# Altium project Aquecedor_Inteligente.PrjPcb
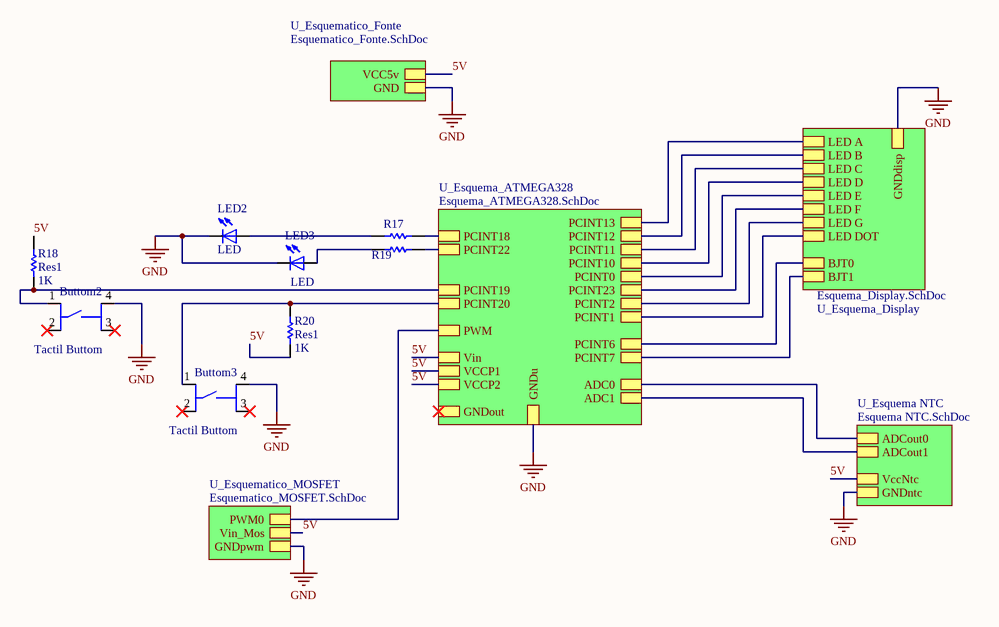
[diagram p0: Esquema_Principal.SchDoc]
6 sheets, 52 parts. Net scope: hierarchical (ports join the sheet entries above them; power ports are global).
Board file: PCB_Aquecedor.PcbDoc
Sheets:
  Esquema_Principal.SchDoc
    U_Esquema_ATMEGA328 = Esquema_ATMEGA328.SchDoc
    U_Esquema_Display = Esquema_Display.SchDoc
    U_Esquematico_Fonte = Esquematico_Fonte.SchDoc
    U_Esquema NTC = Esquema NTC.SchDoc
    U_Esquematico_MOSFET = Esquematico_MOSFET.SchDoc

## Sheet Esquema_Principal.SchDoc
size A4

### Parts
Buttom2  Tactil Buttom  [Tactil Buttom]
Buttom3  Tactil Buttom  [Tactil Buttom]
LED2  LED  [Led_THT]
LED3  LED  [Led_THT]
R17  Res1  [AXIAL-0.3]  (value not drawn)
R18  Res1  value 1K  [AXIAL-0.3]
R19  Res1  [AXIAL-0.3]  (value not drawn)
R20  Res1  value 1K  [AXIAL-0.3]

### Sub-sheets
U_Esquema NTC = Esquema NTC.SchDoc: ADCout0, ADCout1, GNDntc, VccNtc
U_Esquema_ATMEGA328 = Esquema_ATMEGA328.SchDoc: Vin, PCINT18, PCINT19, PCINT6, PCINT7, PWM, PCINT22, PCINT23, PCINT0, PCINT13, PCINT12, PCINT11, PCINT10, ADC1, ADC0, GNDout, PCINT2, PCINT1, PCINT20, VCCP1, VCCP2, GNDu
U_Esquema_Display = Esquema_Display.SchDoc: BJT0, BJT1, LED A, LED B, LED C, LED D, LED E, LED F, LED G, LED DOT, GNDdisp
U_Esquematico_Fonte = Esquematico_Fonte.SchDoc: VCC5v, GND
U_Esquematico_MOSFET = Esquematico_MOSFET.SchDoc: PWM0, Vin_Mos, GNDpwm

### Nets
GND: Buttom2.4 Buttom3.4 LED2.K(C) LED3.K(C) ; sheet U_Esquema_ATMEGA328/GNDu, sheet U_Esquema_Display/GNDdisp, sheet U_Esquematico_Fonte/GND, sheet U_Esquema NTC/GNDntc, sheet U_Esquematico_MOSFET/GNDpwm
5V: R18.2 R20.1 ; sheet U_Esquema_ATMEGA328/Vin, sheet U_Esquema_ATMEGA328/VCCP1, sheet U_Esquema_ATMEGA328/VCCP2, sheet U_Esquematico_Fonte/VCC5v, sheet U_Esquema NTC/VccNtc, sheet U_Esquematico_MOSFET/Vin_Mos
NetButtom2_1: Buttom2.1 R18.1 ; sheet U_Esquema_ATMEGA328/PCINT19
NetButtom3_1: Buttom3.1 R20.2 ; sheet U_Esquema_ATMEGA328/PCINT20
NetCAP3_1: sheet U_Esquema_ATMEGA328/ADC0, sheet U_Esquema NTC/ADCout0
NetCAP7_1: sheet U_Esquema_ATMEGA328/ADC1, sheet U_Esquema NTC/ADCout1
NetIC1_4: R17.2 ; sheet U_Esquema_ATMEGA328/PCINT18
NetIC1_9: sheet U_Esquema_ATMEGA328/PCINT6, sheet U_Esquema_Display/BJT0
NetIC1_10: sheet U_Esquema_ATMEGA328/PCINT7, sheet U_Esquema_Display/BJT1
NetIC1_11: sheet U_Esquema_ATMEGA328/PWM, sheet U_Esquematico_MOSFET/PWM0
NetIC1_12: R19.2 ; sheet U_Esquema_ATMEGA328/PCINT22
NetIC1_13: sheet U_Esquema_ATMEGA328/PCINT23, sheet U_Esquema_Display/LED F
NetIC1_14: sheet U_Esquema_ATMEGA328/PCINT0, sheet U_Esquema_Display/LED E
NetIC1_15: sheet U_Esquema_ATMEGA328/PCINT1, sheet U_Esquema_Display/LED DOT
NetIC1_16: sheet U_Esquema_ATMEGA328/PCINT2, sheet U_Esquema_Display/LED G
NetIC1_25: sheet U_Esquema_ATMEGA328/PCINT10, sheet U_Esquema_Display/LED D
NetIC1_26: sheet U_Esquema_ATMEGA328/PCINT11, sheet U_Esquema_Display/LED C
NetIC1_27: sheet U_Esquema_ATMEGA328/PCINT12, sheet U_Esquema_Display/LED B
NetIC1_28: sheet U_Esquema_ATMEGA328/PCINT13, sheet U_Esquema_Display/LED A
NetLED2_A: LED2.A R17.1
NetLED3_A: LED3.A R19.1

Not connected (* = marked no-connect by the designer): Buttom2 2* 3*; Buttom3 2* 3*

### Library data of the parts
R17 R19 = Res1: Resistor; Value: 1K; Published: 8-Jun-2000; LatestRevisionDate: 17-Jul-2002; LatestRevisionNote: Re-released for DXP Platform.; PackageReference: AXIAL-0.3; Publisher: Altium Limited; PackageDescription: Axial Device, Thru-Hole; 2 Leads; 0.3 in Pin Spacing
R18 R20 = Res1: Resistor; Published: 8-Jun-2000; LatestRevisionDate: 17-Jul-2002; LatestRevisionNote: Re-released for DXP Platform.; PackageReference: AXIAL-0.3; Publisher: Altium Limited; PackageDescription: Axial Device, Thru-Hole; 2 Leads; 0.3 in Pin Spacing

## Sheet Esquema_ATMEGA328.SchDoc
size A4
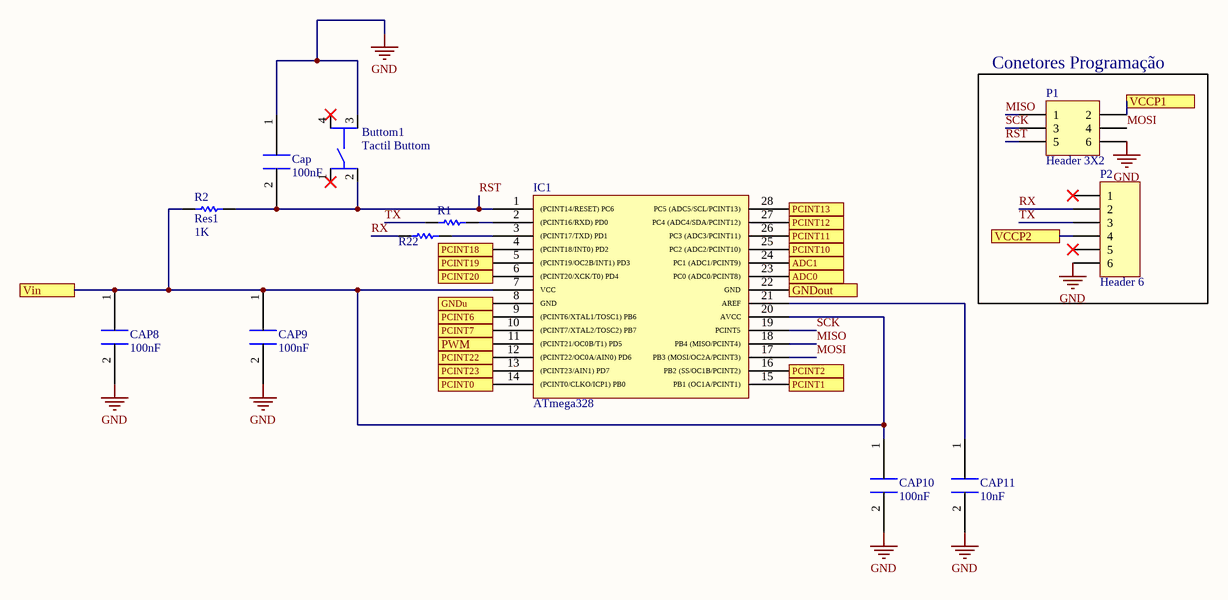
[diagram p1: Esquema_ATMEGA328.SchDoc]

### Parts
Buttom1  Tactil Buttom  [Tactil Buttom]
Cap  100nF  [Capacitor Eletro]
CAP8  100nF  [Capacitor Eletro]
CAP9  100nF  [Capacitor Eletro]
CAP10  100nF  [Capacitor Eletro]
CAP11  10nF  [Capacitor Eletro]
IC1  ATmega328  [ATmega328]
P1  Header 3X2  [HDR2X3]
P2  Header 6  [HDR1X6]
R1  Res1  [AXIAL-0.3]  (value not drawn)
R2  Res1  value 1K  [AXIAL-0.3]
R22  Res1  [AXIAL-0.3]  (value not drawn)

### Blocks framed on the sheet
Conetores Programação: P1 P2

### Ports
ADC0, ADC1, GNDout, GNDu, PCINT0, PCINT1, PCINT2, PCINT6, PCINT7, PCINT10, PCINT11, PCINT12, PCINT13, PCINT18, PCINT19, PCINT20, PCINT22, PCINT23, PWM, VCCP1, VCCP2, Vin

### Nets
GND: Buttom1.3 Cap.1 CAP8.2 CAP9.2 CAP10.2 CAP11.2 IC1.8(GND) P1.6 P2.6 ; port GNDu
5V: CAP8.1 CAP9.1 CAP10.1 IC1.7(VCC) IC1.20(AVCC) P1.2 P2.4 R2.1 ; port Vin, port VCCP1, port VCCP2
MISO: IC1.18(PB4_(MISO/PCINT4)) P1.1
MOSI: IC1.17(PB3_(MOSI/OC2A/PCINT3)) P1.4
RST: Buttom1.2 Cap.2 IC1.1((PCINT14/RESET)_PC6) P1.5 R2.2
RX: P2.2 R22.1
SCK: IC1.19(PCINT5) P1.3
TX: P2.3 R1.1
NetButtom2_1: IC1.5((PCINT19/OC2B/INT1)_PD3) ; port PCINT19
NetButtom3_1: IC1.6((PCINT20/XCK/T0)_PD4) ; port PCINT20
NetCAP3_1: IC1.23(PC0_(ADC0/PCINT8)) ; port ADC0
NetCAP7_1: IC1.24(PC1_(ADC1/PCINT9)) ; port ADC1
NetCAP11_1: CAP11.1 IC1.21(AREF)
NetIC1_2: IC1.2((PCINT16/RXD)_PD0) R1.2
NetIC1_3: IC1.3((PCINT17/TXD)_PD1) R22.2
NetIC1_4: IC1.4((PCINT18/INT0)_PD2) ; port PCINT18
NetIC1_9: IC1.9((PCINT6/XTAL1/TOSC1)_PB6) ; port PCINT6
NetIC1_10: IC1.10((PCINT7/XTAL2/TOSC2)_PB7) ; port PCINT7
NetIC1_11: IC1.11((PCINT21/OC0B/T1)_PD5) ; port PWM
NetIC1_12: IC1.12((PCINT22/OC0A/AIN0)_PD6) ; port PCINT22
NetIC1_13: IC1.13((PCINT23/AIN1)_PD7) ; port PCINT23
NetIC1_14: IC1.14((PCINT0/CLKO/ICP1)_PB0) ; port PCINT0
NetIC1_15: IC1.15(PB1_(OC1A/PCINT1)) ; port PCINT1
NetIC1_16: IC1.16(PB2_(SS/OC1B/PCINT2)) ; port PCINT2
NetIC1_22: IC1.22(GND) ; port GNDout
NetIC1_25: IC1.25(PC2_(ADC2/PCINT10)) ; port PCINT10
NetIC1_26: IC1.26(PC3_(ADC3/PCINT11)) ; port PCINT11
NetIC1_27: IC1.27(PC4_(ADC4/SDA/PCINT12)) ; port PCINT12
NetIC1_28: IC1.28(PC5_(ADC5/SCL/PCINT13)) ; port PCINT13

Not connected (* = marked no-connect by the designer): Buttom1 1* 4*; P2 1* 5*

### Library data of the parts
Cap CAP8-CAP11 = 33pF: Condensador
P1 = Header 3X2: Header, 3-Pin, Dual row; LatestRevisionDate: 17-Jul-2002; LatestRevisionNote: Re-released for DXP Platform.; Publisher: Altium Limited
P2 = Header 6: Header, 6-Pin; LatestRevisionDate: 17-Jul-2002; LatestRevisionNote: Re-released for DXP Platform.; Publisher: Altium Limited
R1 R22 = Res1: Resistor; Value: 1K; Published: 8-Jun-2000; LatestRevisionDate: 17-Jul-2002; LatestRevisionNote: Re-released for DXP Platform.; PackageReference: AXIAL-0.3; Publisher: Altium Limited; PackageDescription: Axial Device, Thru-Hole; 2 Leads; 0.3 in Pin Spacing
R2 = Res1: Resistor; Published: 8-Jun-2000; LatestRevisionDate: 17-Jul-2002; LatestRevisionNote: Re-released for DXP Platform.; PackageReference: AXIAL-0.3; Publisher: Altium Limited; PackageDescription: Axial Device, Thru-Hole; 2 Leads; 0.3 in Pin Spacing

## Sheet Esquema_Display.SchDoc
size A4
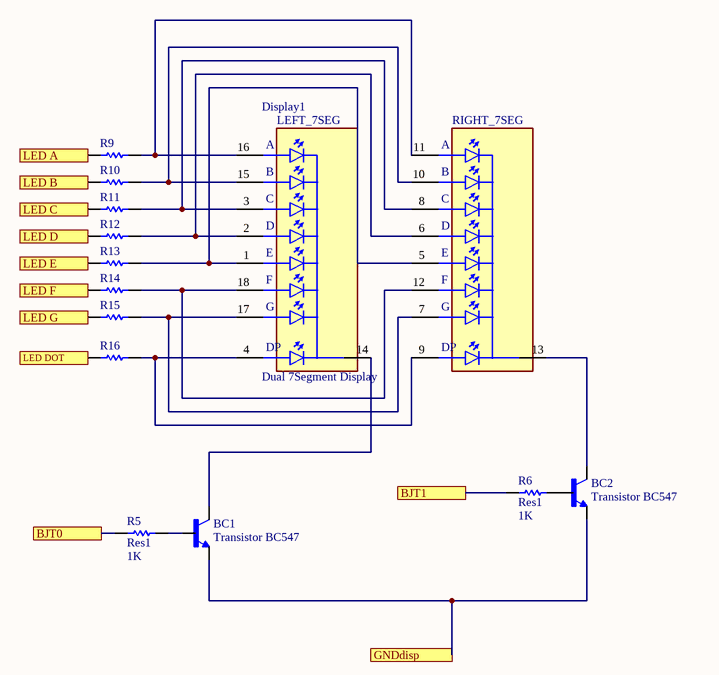
[diagram p2: Esquema_Display.SchDoc]

### Parts
BC1  Transistor BC547  [Transistor BC547]
BC2  Transistor BC547  [Transistor BC547]
Display1  Dual 7Segment Display  [Dual Digit Display]
R5  Res1  value 1K  [AXIAL-0.3]
R6  Res1  value 1K  [AXIAL-0.3]
R9  Res1  [AXIAL-0.3]  (value not drawn)
R10  Res1  [AXIAL-0.3]  (value not drawn)
R11  Res1  [AXIAL-0.3]  (value not drawn)
R12  Res1  [AXIAL-0.3]  (value not drawn)
R13  Res1  [AXIAL-0.3]  (value not drawn)
R14  Res1  [AXIAL-0.3]  (value not drawn)
R15  Res1  [AXIAL-0.3]  (value not drawn)
R16  Res1  [AXIAL-0.3]  (value not drawn)

### Ports
BJT0, BJT1, GNDdisp, LED A, LED B, LED C, LED D, LED DOT, LED E, LED F, LED G

### Nets
GND: BC1.1(E) BC2.1(E) ; port GNDdisp
NetBC1_2: BC1.2(B) R5.2
NetBC1_3: BC1.3(C) Display1.14(COM_1)
NetBC2_2: BC2.2(B) R6.2
NetBC2_3: BC2.3(C) Display1.13(COM_2)
NetDisplay1_1: Display1.1(E_1) Display1.5(E_2) R13.2
NetDisplay1_2: Display1.2(D_1) Display1.6(D_2) R12.2
NetDisplay1_3: Display1.3(C_1) Display1.8(C_2) R11.2
NetDisplay1_4: Display1.4(DP_1) Display1.9(DP_2) R16.2
NetDisplay1_7: Display1.7(G_2) Display1.17(G_1) R15.2
NetDisplay1_10: Display1.10(B_2) Display1.15(B_1) R10.2
NetDisplay1_11: Display1.11(A_2) Display1.16(A_1) R9.2
NetDisplay1_12: Display1.12(F_2) Display1.18(F_1) R14.2
NetIC1_9: R5.1 ; port BJT0
NetIC1_10: R6.1 ; port BJT1
NetIC1_13: R14.1 ; port LED F
NetIC1_14: R13.1 ; port LED E
NetIC1_15: R16.1 ; port LED DOT
NetIC1_16: R15.1 ; port LED G
NetIC1_25: R12.1 ; port LED D
NetIC1_26: R11.1 ; port LED C
NetIC1_27: R10.1 ; port LED B
NetIC1_28: R9.1 ; port LED A

### Notes on the sheet
- (in symbol Dual 7Segment Display) LEFT_7SEG; RIGHT_7SEG; A; B; C; D; E; F; G; DP

### Library data of the parts
R5 R6 = Res1: Resistor; Published: 8-Jun-2000; LatestRevisionDate: 17-Jul-2002; LatestRevisionNote: Re-released for DXP Platform.; PackageReference: AXIAL-0.3; Publisher: Altium Limited; PackageDescription: Axial Device, Thru-Hole; 2 Leads; 0.3 in Pin Spacing
R9-R16 = Res1: Resistor; Value: 1K; Published: 8-Jun-2000; LatestRevisionDate: 17-Jul-2002; LatestRevisionNote: Re-released for DXP Platform.; PackageReference: AXIAL-0.3; Publisher: Altium Limited; PackageDescription: Axial Device, Thru-Hole; 2 Leads; 0.3 in Pin Spacing

## Sheet Esquematico_Fonte.SchDoc
size A4
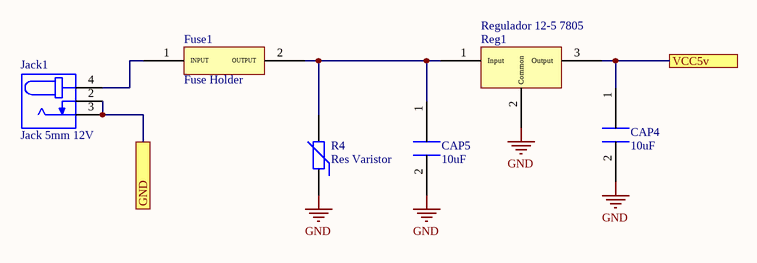
[diagram p3: Esquematico_Fonte.SchDoc]

### Parts
CAP4  10uF  [Capacitor Eletro]
CAP5  10uF  [Capacitor Eletro]
Fuse1  Fuse Holder  [Fuse Holder]
Jack1  Jack 5mm 12V  [Jack 5mm]
R4  Res Varistor  [6-0805_N]
Reg1  Regulador 12-5 7805  [Regulador 12-5 7805]

### Ports
GND, VCC5v

### Nets
GND: CAP4.2 CAP5.2 Jack1.2 Jack1.3 R4.1 Reg1.2(Common) ; port GND
5V: CAP4.1 Reg1.3(Output) ; port VCC5v
NetCAP5_1: CAP5.1 Fuse1.2(OUTPUT) R4.2 Reg1.1(Input)
NetFuse1_1: Fuse1.1(INPUT) Jack1.4

### Library data of the parts
CAP4 CAP5 = 33pF: Condensador
R4 = Res Varistor: Varistor (Voltage-Sensitive Resistor); Published: 24-Mar-1999; LatestRevisionDate: 29-May-2009; LatestRevisionNote: IPC-7351 Footprint Added.; PackageVersion: Mar-2003; PackageReference: 6-0805; Publisher: Altium Limited; PackageDescription: Chip Resistor 0805 Case Size; Code_IPC: RESC2012

## Sheet Esquema NTC.SchDoc
size A4
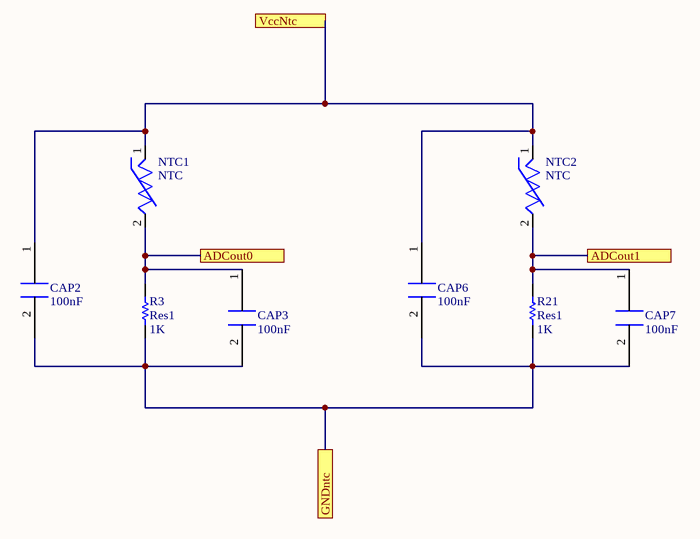
[diagram p4: Esquema NTC.SchDoc]

### Parts
CAP2  100nF  [Capacitor Eletro]
CAP3  100nF  [Capacitor Eletro]
CAP6  100nF  [Capacitor Eletro]
CAP7  100nF  [Capacitor Eletro]
NTC1  NTC  [NTC]
NTC2  NTC  [NTC]
R3  Res1  value 1K  [AXIAL-0.3]
R21  Res1  value 1K  [AXIAL-0.3]

### Ports
ADCout0, ADCout1, GNDntc, VccNtc

### Nets
GND: CAP2.2 CAP3.2 CAP6.2 CAP7.2 R3.1 R21.1 ; port GNDntc
5V: CAP2.1 CAP6.1 NTC1.1 NTC2.1 ; port VccNtc
NetCAP3_1: CAP3.1 NTC1.2 R3.2 ; port ADCout0
NetCAP7_1: CAP7.1 NTC2.2 R21.2 ; port ADCout1

### Library data of the parts
CAP2 CAP3 CAP6 CAP7 = 33pF: Condensador
R3 R21 = Res1: Resistor; Published: 8-Jun-2000; LatestRevisionDate: 17-Jul-2002; LatestRevisionNote: Re-released for DXP Platform.; PackageReference: AXIAL-0.3; Publisher: Altium Limited; PackageDescription: Axial Device, Thru-Hole; 2 Leads; 0.3 in Pin Spacing

## Sheet Esquematico_MOSFET.SchDoc
size A4
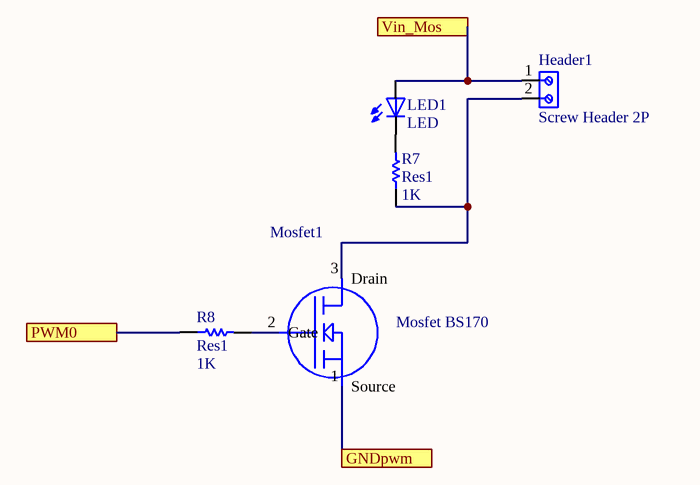
[diagram p5: Esquematico_MOSFET.SchDoc]

### Parts
Header1  Screw Header 2P  [Screw Header 2 Posicoes]
LED1  LED  [Led_THT]
Mosfet1  Mosfet BS170  [Mosfet BS170]
R7  Res1  value 1K  [AXIAL-0.3]
R8  Res1  value 1K  [AXIAL-0.3]

### Ports
GNDpwm, PWM0, Vin_Mos

### Nets
GND: Mosfet1.1(Source) ; port GNDpwm
5V: Header1.1 LED1.A ; port Vin_Mos
NetHeader1_2: Header1.2 Mosfet1.3(Drain) R7.1
NetIC1_11: R8.1 ; port PWM0
NetLED1_K: LED1.K(C) R7.2
NetMosfet1_2: Mosfet1.2(Gate) R8.2

### Library data of the parts
R7 R8 = Res1: Resistor; Published: 8-Jun-2000; LatestRevisionDate: 17-Jul-2002; LatestRevisionNote: Re-released for DXP Platform.; PackageReference: AXIAL-0.3; Publisher: Altium Limited; PackageDescription: Axial Device, Thru-Hole; 2 Leads; 0.3 in Pin Spacing

## Nets that join several sheets
GND: Esquema_Principal (Buttom2.4 Buttom3.4 LED2.K LED3.K), Esquema_ATMEGA328 (9 pins), Esquema_Display (BC1.1 BC2.1), Esquematico_Fonte (6 pins), Esquema NTC (6 pins), Esquematico_MOSFET (Mosfet1.1)
5V: Esquema_Principal (R18.2 R20.1), Esquema_ATMEGA328 (8 pins), Esquematico_Fonte (CAP4.1 Reg1.3), Esquema NTC (CAP2.1 CAP6.1 NTC1.1 NTC2.1), Esquematico_MOSFET (Header1.1 LED1.A)
NetButtom2_1: Esquema_Principal (Buttom2.1 R18.1), Esquema_ATMEGA328 (IC1.5)
NetButtom3_1: Esquema_Principal (Buttom3.1 R20.2), Esquema_ATMEGA328 (IC1.6)
NetCAP3_1: Esquema_ATMEGA328 (IC1.23), Esquema NTC (CAP3.1 NTC1.2 R3.2)
NetCAP7_1: Esquema_ATMEGA328 (IC1.24), Esquema NTC (CAP7.1 NTC2.2 R21.2)
NetIC1_4: Esquema_Principal (R17.2), Esquema_ATMEGA328 (IC1.4)
NetIC1_9: Esquema_ATMEGA328 (IC1.9), Esquema_Display (R5.1)
NetIC1_10: Esquema_ATMEGA328 (IC1.10), Esquema_Display (R6.1)
NetIC1_11: Esquema_ATMEGA328 (IC1.11), Esquematico_MOSFET (R8.1)
NetIC1_12: Esquema_Principal (R19.2), Esquema_ATMEGA328 (IC1.12)
NetIC1_13: Esquema_ATMEGA328 (IC1.13), Esquema_Display (R14.1)
NetIC1_14: Esquema_ATMEGA328 (IC1.14), Esquema_Display (R13.1)
NetIC1_15: Esquema_ATMEGA328 (IC1.15), Esquema_Display (R16.1)
NetIC1_16: Esquema_ATMEGA328 (IC1.16), Esquema_Display (R15.1)
NetIC1_25: Esquema_ATMEGA328 (IC1.25), Esquema_Display (R12.1)
NetIC1_26: Esquema_ATMEGA328 (IC1.26), Esquema_Display (R11.1)
NetIC1_27: Esquema_ATMEGA328 (IC1.27), Esquema_Display (R10.1)
NetIC1_28: Esquema_ATMEGA328 (IC1.28), Esquema_Display (R9.1)